# EAGLE design Main (EAGLE 7.1.0)

## Sheet 1 of 2
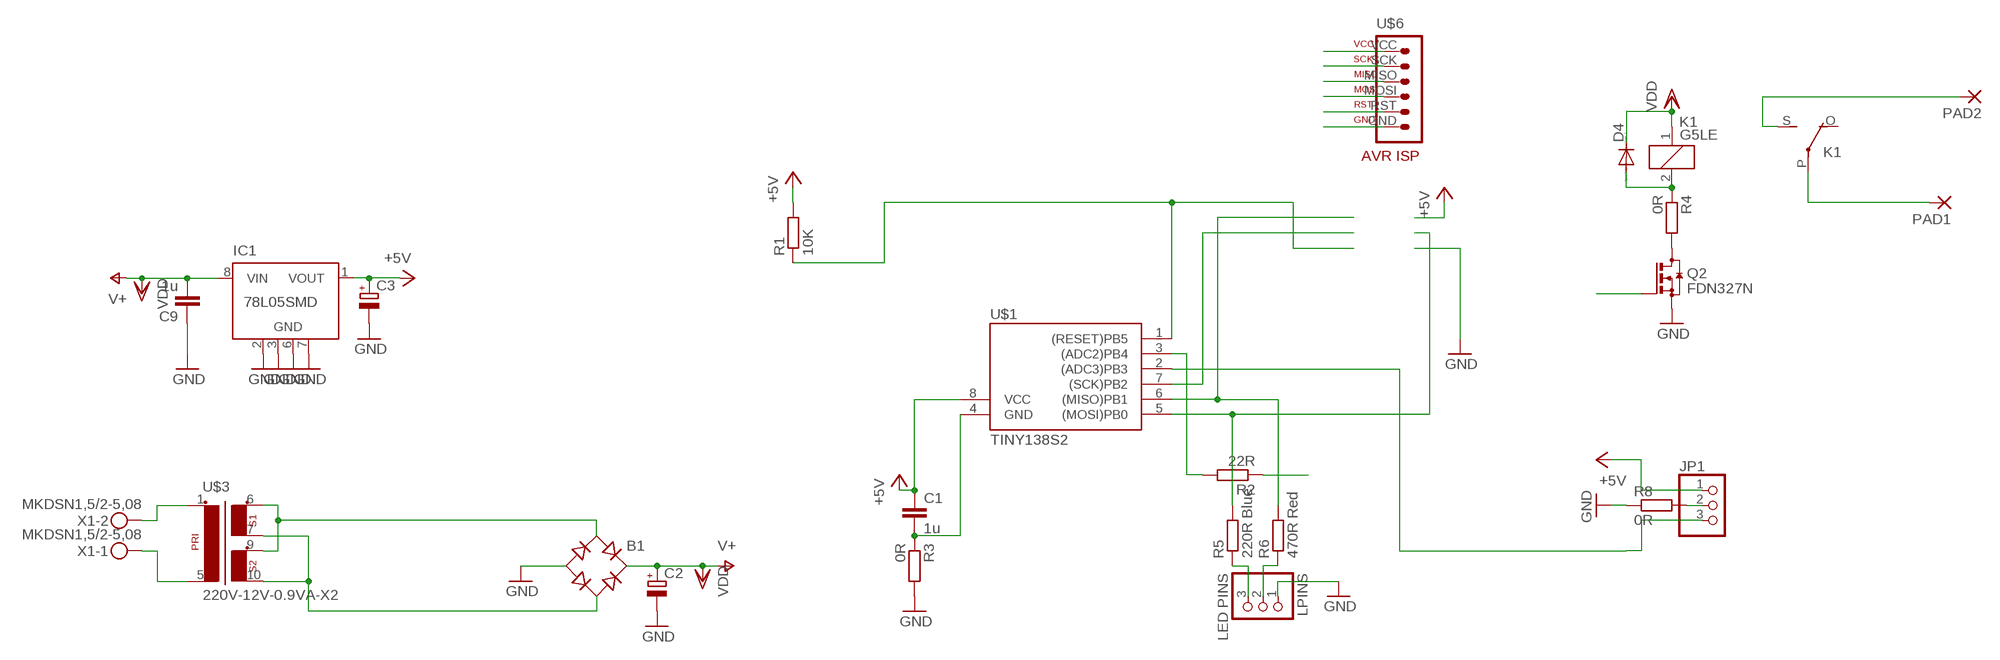
[diagram p0: schematic, sheet 1]

### Parts
B1  RB1A  [RB1A]
C1  1u  C-EUC1206  [C1206]
C2  CPOL-EUE5-13  [E5-13]
C3  CPOL-EUE2.5-7  [E2,5-7]
C9  1u  C-EUC1206  [C1206]
D4  DIODE-DO-214AC  [DO-214AC]
IC1  78L05SMD  [SO08]
JP1  PINHD-1X3/90  [1X03/90]
K1  G5LE  [G5LE]
LPINS  LED PINS  PINHD-1X3  [1X03]
PAD1  3,81/1,4  [3,81/1,4]
PAD2  3,81/1,4  [3,81/1,4]
Q2  FDN327N  BSS123  [SOT23]
R1  10K  R-EU_R1206  [R1206]
R2  22R  R-EU_R1206  [R1206]
R3  0R  R-EU_R1206  [R1206]
R4  0R  R-EU_R1206  [R1206]
R5  220R Blue  R-EU_R1206  [R1206]
R6  470R Red  R-EU_R1206  [R1206]
R8  0R  R-EU_R1206  [R1206]
U$1  TINY138S2  [SO08]
U$3  220V-12V-0.9VA-X2  [32.5-27.5-22]
U$6  AVR-ISP-6-ROW  [AVR-ISP-6-ROW]
X1  MKDSN1,5/2-5,08  [MKDSN1,5/2-5,08]

### Nets
+5V: C1.1 C3.+ IC1.1(VOUT) JP1.1 R1.2 U$1.8(VCC) U$6.VCC
GND: B1.- C2.- C3.- C9.1 IC1.2(GND) IC1.3(GND) IC1.6(GND) IC1.7(GND) LPINS.1 Q2.2(S) R3.2 R8.1 U$6.GND
N$1: R1.1 U$1.1((RESET)PB5) U$6.RST
N$3: U$1.7((SCK)PB2) U$6.SCK
N$4: R6.2 U$1.6((MISO)PB1) U$6.MISO
N$5: R5.2 U$1.5((MOSI)PB0) U$6.MOSI
N$9: Q2.1(G) R2.1
N$10: R2.2 U$1.3((ADC2)PB4)
N$11: LPINS.3 R5.1
N$12: LPINS.2 R6.1
N$13: D4.A K1.2 R4.1
N$14: U$3.1(P1-1) X1.2
N$15: U$3.5(P1-2) X1.1
N$16: B1.AC1 U$3.6(S1-1) U$3.9(S2-1)
N$17: B1.AC2 U$3.7(S1-2) U$3.10(S2-2)
N$18: Q2.3(D) R4.2
N$19: C1.2 R3.1 U$1.4(GND)
N$21: K1.P(2:P) PAD1.1(P)
N$22: K1.S(2:S) PAD2.1(P)
N$23: JP1.2 R8.2
N$70: JP1.3 U$1.2((ADC3)PB3)
VDD: B1.+ C2.+ C9.2 D4.C IC1.8(VIN) K1.1 ; supply symbol labelled V+
Unconnected: IC1.4(NC) IC1.5(NC) K1.O(2:O)

## Sheet 2 of 2
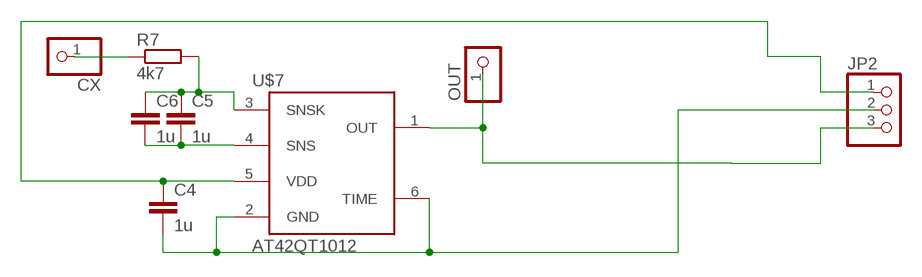
[diagram p1: schematic, sheet 2]

### Parts
C4  1u  C-EUC1206  [C1206]
C5  1u  C-EUC1206  [C1206]
C6  1u  C-EUC1206  [C1206]
CX  PINHD-1X1  [1X01]
JP2  PINHD-1X3/90  [1X03/90]
OUT  PINHD-1X1  [1X01]
R7  4k7  R-EU_R1206  [R1206]
U$7  AT42QT1012  [SOT23-6]

### Nets
N$2: CX.1 R7.1
N$6: C5.2 C6.2 U$7.4(SNS)
N$7: JP2.3 OUT.1 U$7.1(OUT)
N$8: C5.1 C6.1 R7.2 U$7.3(SNSK)
N$24: C4.1 JP2.1 U$7.5(VDD)
N$26: C4.2 JP2.2 U$7.2(GND) U$7.6(TIME)

## Library data of the parts
B1 = rectifier:RB1A: RECTIFIER 1 A
C1 C4-C6 C9 = rcl:C-EU: CAPACITOR, European symbol
C2 C3 = rcl:CPOL-EU: POLARIZED CAPACITOR, European symbol
CX OUT = pinhead:PINHD-1X1: PIN HEADER
D4 = diode:DIODE-: DIODE
IC1 = linear:78L*SMD: Positive VOLTAGE REGULATOR
JP1 JP2 LPINS = pinhead:PINHD-1X3: PIN HEADER
K1 = relay:G5LE: RELAY 1 x switch, 10 A/120 V AC, 8 A/30 V DC, Omron; OC_FARNELL: unknown; OC_NEWARK: unknown
PAD1 PAD2 = wirepad:3,81/1,4: THROUGH-HOLE PAD
Q2 = transistor-small-signal:BSS123: N-CHANNEL MOS FET
R1-R8 = rcl:R-EU_: RESISTOR, European symbol
U$1 = avr-7:TINY13*
U$3 = _Transformers:220V-12V-0.9VA-X2
U$6 = Namenlos:AVR-ISP-6-ROW
U$7 = Namenlos:AT42QT1012
X1 = con-phoenix-508:MKDSN1,5/2-5,08: MKDSN 1,5/ 2-5,08 Printklemme Nennstrom: 13,5 A Nennspannung: 250 V Rastermaß: 5,08 mm Polzahl: 2 Anschlussart: Schraubanschluss Montage: Löten Anschlussrichtung Leiter/Platine: 0 ° Artikelnummer: 1729128 Source: http://eshop.phoenixcontact.com .. 1729128.pdf

## Board
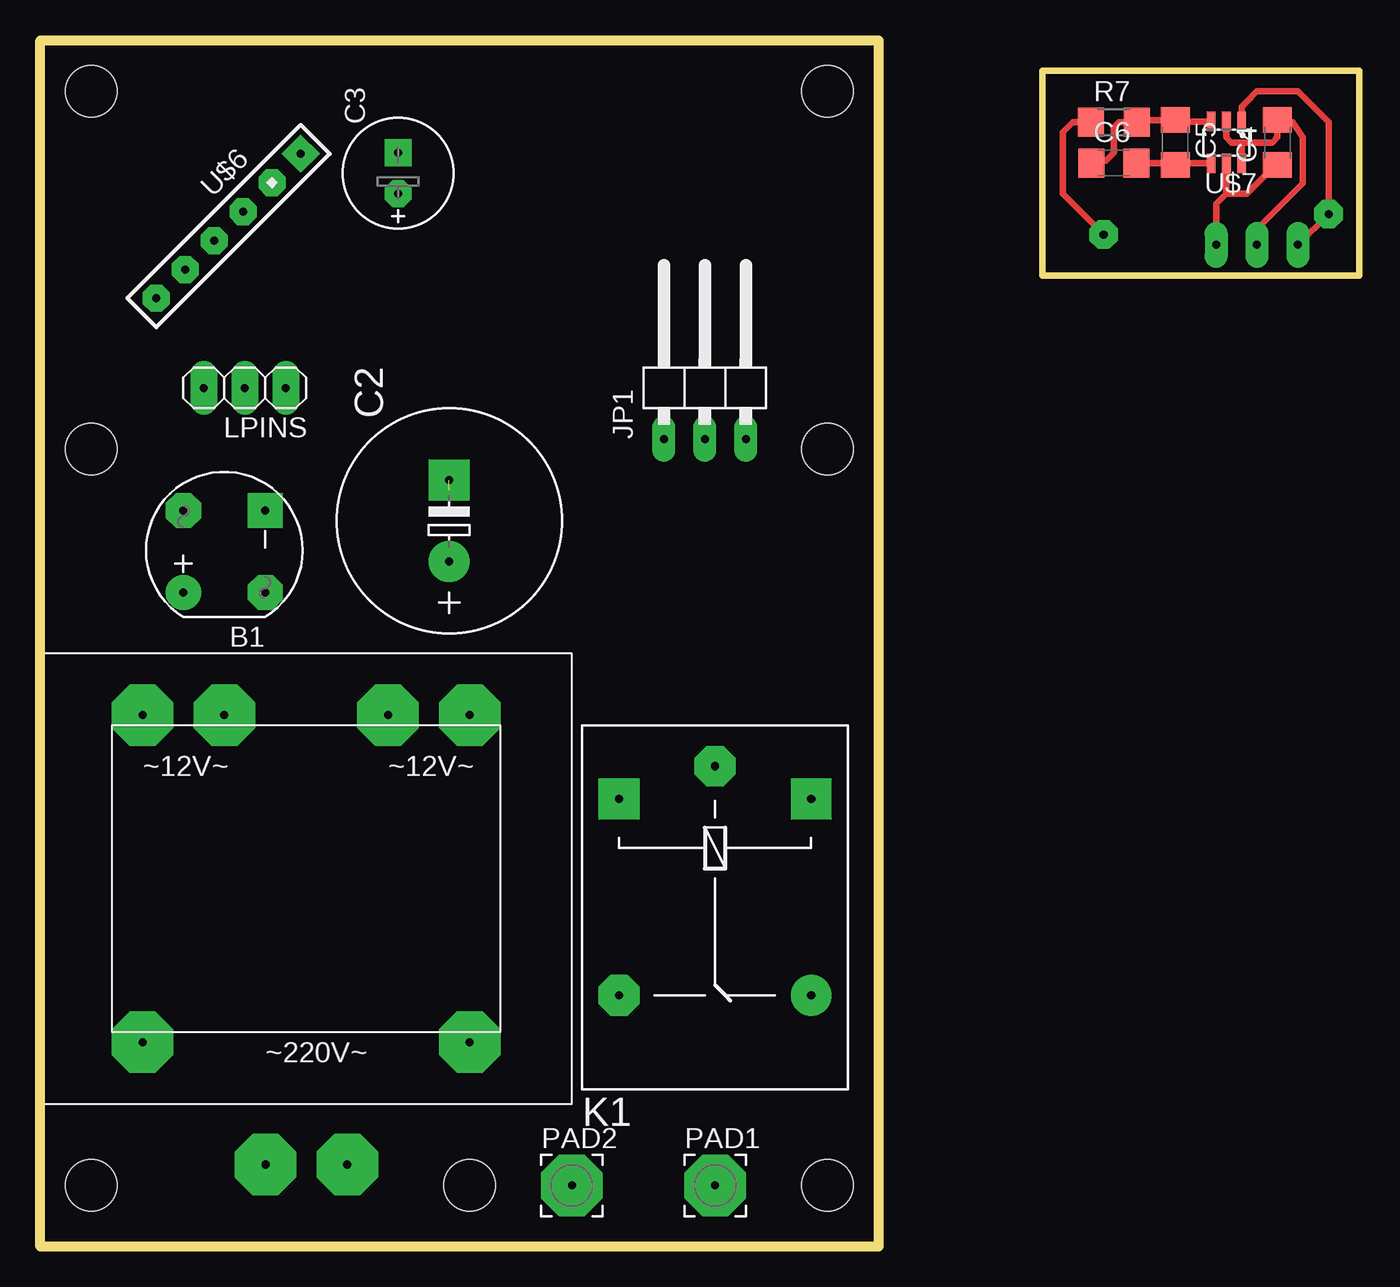
[diagram p2: board, top side]
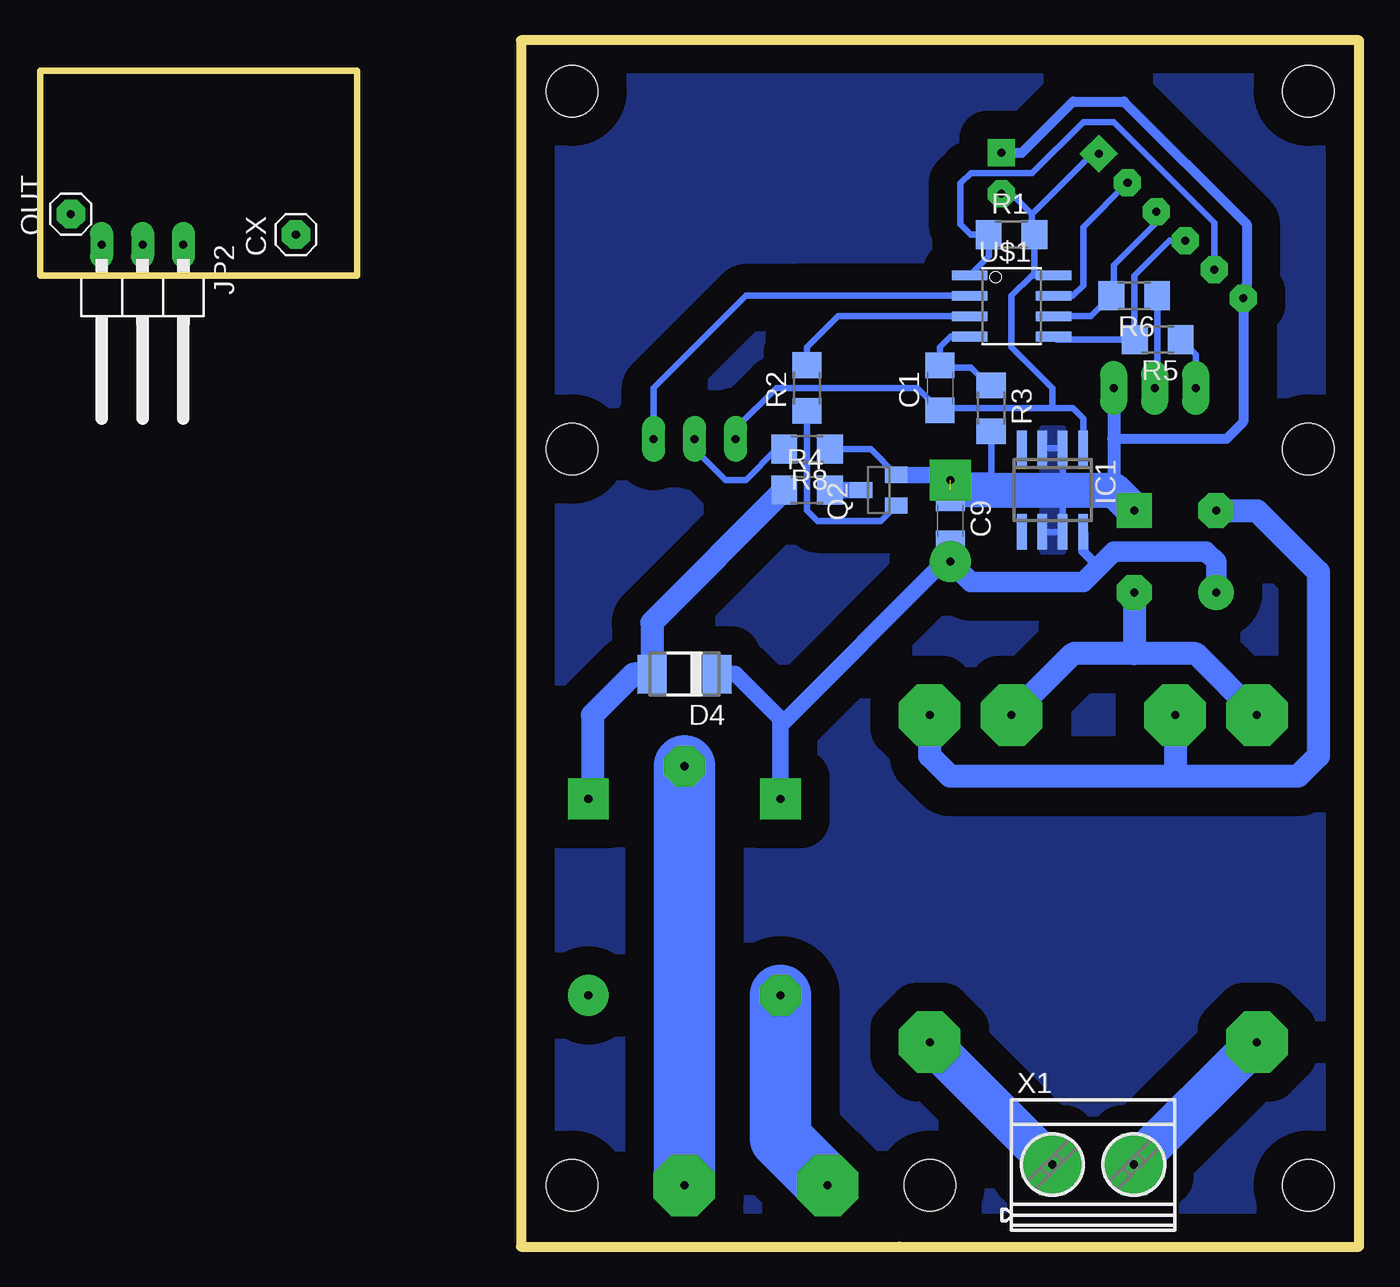
[diagram p3: board, bottom side, seen from below]

Size 81.92 x 74.93 mm. Coordinates in mm from the lower left corner, seen from the top.
Outline: 28.57,0 0,0 0,74.93 52.07,74.93 52.07,0 28.57,0
Outline: 81.92,60.33 81.92,73.03 62.23,73.03 62.23,60.33 81.92,60.33
Copper layers (1*16): Top 0.035mm / dielectric 1.5mm / Bottom 0.035mm
Design rules "default": minimum track width 10mil, minimum drill 24mil, track to track 8mil, track to pad 8mil, pad to pad 8mil, via to via 8mil, smd to smd 8mil, copper to edge 40mil, drill to drill 8mil, minimum pad ring 10mil, minimum via ring 8mil, stop-mask expansion 4mil, vias tented up to drill 0mil, thermal gap 10mil
Holes 3.2 mm at 3.17,71.75 3.17,49.53 48.9,49.53 48.9,71.75 3.17,3.81 48.9,3.81 26.67,3.81

### Footprints (pad centres in the part's own frame; a part is rotated, then mirrored left to right if it is on the bottom)
RB1A = drill 0.5 pad 2.184: + -2.54,2.54 | drill 0.5 pad 2.184 square: - 2.54,-2.54 | drill 0.5 pad 2.184 octagon: AC1 2.54,2.54; AC2 -2.54,-2.54
C1206 = smd 1.6 x 1.8: 1 -1.4,0; 2 1.4,0
E5-13 = drill 0.5 pad 2.54: + -2.54,0 | drill 0.5 pad 2.54 square: - 2.54,0
E2,5-7 = drill 0.5 pad 1.676 octagon: + -1.27,0 | drill 0.5 pad 1.676 square: - 1.27,0
1X01 = drill 0.5 pad 1.778 octagon: 1 0,0
DO-214AC = smd 1.8 x 2.4: A 2.025,0; C -2.025,0
SO08 = smd 0.6 x 2.2: 1 -1.905,-2.6; 2 -0.635,-2.6; 3 0.635,-2.6; 4 1.905,-2.6; 5 1.905,2.6; 6 0.635,2.6; 7 -0.635,2.6; 8 -1.905,2.6
1X03/90 = drill 0.5 pad 1.422 long: 1 -2.54,-3.81; 2 0,-3.81; 3 2.54,-3.81
G5LE = drill 0.5 pad 2.54 square: 1 -7.493,-5.969; 2 -7.493,5.969 | drill 0.5 pad 2.54: O 4.699,5.969 | drill 0.5 pad 2.54 octagon: P -9.525,0; S 4.699,-5.969
1X03 = drill 0.5 pad 1.676 long: 1 -2.54,0; 2 0,0; 3 2.54,0
3,81/1,4 = drill 0.5 pad 3.81 octagon: 1 0,0
SOT23 = smd 1 x 1.4: 1 -0.95,-1.1; 2 0.95,-1.1; 3 0,1.1
R1206 = smd 1.6 x 1.803: 1 -1.422,0; 2 1.422,0
SO08' = smd 0.61 x 2.21: 1 -1.905,-2.616; 2 -0.635,-2.616; 3 0.635,-2.616; 4 1.905,-2.616; 5 1.905,2.616; 6 0.635,2.616; 7 -0.635,2.616; 8 -1.905,2.616
32.5-27.5-22 = drill 0.5 pad 3.81 octagon: 1 -10.16,-10.16; 5 10.16,-10.16; 6 10.16,10.16; 7 5.08,10.16; 9 -5.08,10.16; 10 -10.16,10.16
AVR-ISP-6-ROW = drill 0.5 pad 1.676 octagon: GND 6.35,0; MISO -1.27,0; MOSI 1.27,0; RST 3.81,0; SCK -3.81,0 | drill 0.5 pad 1.676 square: VCC -6.35,0
SOT23-6 = smd 0.55 x 1.2: 1 -0.95,-1.3; 2 0,-1.3; 3 0.95,-1.3; 4 0.95,1.3; 5 0,1.3; 6 -0.95,1.3
MKDSN1,5/2-5,08 = drill 0.5 pad 3.81 octagon: 1 -2.561,0.025; 2 2.519,0.025

### Placement (x,y rotation side)
B1  11.43,43.18 90 top
C1  26.04,53.34 90 bottom
C2  25.4,45.09 90 top
C3  22.23,66.67 90 top
C4  76.83,68.58 90 top
C5  70.48,68.58 270 top
C6  66.67,67.31 0 top
C9  25.4,45.09 270 bottom
CX  66.04,62.87 90 bottom
D4  41.91,35.56 180 bottom
IC1  19.05,46.99 180 bottom
JP1  41.27,53.98 0 top
JP2  75.56,58.42 180 bottom
K1  41.91,20.32 270 top
LPINS  12.7,53.34 180 top
OUT  80.01,64.14 90 bottom
PAD1  41.91,3.81 0 top
PAD2  33.02,3.81 0 top
Q2  29.84,46.99 90 bottom
R1  21.59,62.87 0 bottom
R2  34.29,53.34 90 bottom
R3  22.86,52.07 270 bottom
R4  34.29,46.99 0 bottom
R5  12.51,56.33 180 bottom
R6  13.97,59.05 180 bottom
R7  66.67,69.85 0 top
R8  34.29,49.53 180 bottom
U$1  TINY138S2  [SO08']  21.59,58.42 270 bottom
U$3  16.51,22.86 0 top
U$6  11.69,63.39 225 top
U$7  73.66,68.58 180 top
X1  16.51,5.08 0 bottom

### Tracks (layer width: path | path; a pad name or v marks a point on that pad's centre or on a via)
+5V
  Bottom 0.406: C3.+ 21.59,65.41 20.32,64.14 | 20.32,64.14 20.32,63.02 R1.2 20.17,60.48 20.32,60.33 | IC1.1 17.14,51.44 17.78,52.07 19.05,52.07 | 19.05,52.07 25.91,52.07 C1.1 27.43,53.34 36.2,53.34 38.73,50.8 JP1.1 | 19.05,52.07 19.05,53.34 21.59,55.88 21.59,59.05 20.32,60.33 | 20.32,60.33 U$1.8 | U$6.VCC 16.57,67.88 20.32,64.14
GND  (1 unrouted)
  Bottom 0.406: IC1.6 IC1.7 18.41,46.99 IC1.2 IC1.3 | R3.2 22.86,46.99 | R8.1 30.34,49.53 Q2.2
  Bottom 0.61: C3.- 20.95,67.94 17.78,71.12 14.61,71.12 6.99,63.5 6.99,59.75 U$6.GND 7.2,51.22 8.26,50.16 15.24,50.16
  Bottom 0.813: LPINS.1 15.24,50.16 15.24,46.99
  Bottom 1.016: 25.72,46.67 25.4,46.67 25.4,46.99 24.89,46.99 | 24.77,46.99 24.89,46.99 | 24.89,46.99 C9.1 | Q2.2 25.4,47.94 C2.-
  Bottom 2.184: B1.- 15.24,46.99 18.41,46.99 22.86,46.99 24.77,46.99
  pour Bottom (no thermals): 18.41,43.18 19.68,43.18 19.68,50.8 18.41,50.8
N$1
  Bottom 0.406: R1.1 23.01,63.02 | R1.1 23.01,61.52 U$1.1 | U$6.RST 9,63.61 15.24,69.85 17.14,69.85 20.32,66.67 24.13,66.67 24.77,66.04 24.77,63.5 24.13,62.87 R1.1
N$2
  Top 0.406: CX.1 64.14,64.77 63.5,65.41 63.5,69.22 64.14,69.85 R7.1
N$3
  Bottom 0.406: U$1.7 17.78,59.05 17.14,59.69 17.14,63.33 U$6.SCK
N$4
  Bottom 0.406: U$1.6 16.66,57.78 R6.2 15.24,59.21 15.24,60.96 11.96,64.24 U$6.MISO
N$5
  Bottom 0.406: U$1.5 18.79,56.33 R5.2 13.97,56.36 13.97,60.33 11.8,62.49 U$6.MOSI
N$6
  Top 0.406: U$7.4 70.58,67.28 C5.2 70.36,67.31 C6.2
N$7
  Top 0.406: U$7.1 74.61,70.8 74.93,71.12 75.56,71.75 78.11,71.75 80.01,69.85 80.01,66.04 OUT.1 JP2.3
N$8
  Top 0.406: U$7.3 70.58,69.88 C5.1 68.23,69.98 R7.2 66.99,69.85 66.67,69.53 66.67,67.94 66.19,67.46 65.41,67.46 C6.1
N$9
  Bottom 0.406: R2.1 34.29,45.72 33.66,45.09 29.7,45.09 Q2.1
N$10
  Bottom 0.406: U$1.3 32.38,57.78 34.29,55.88 R2.2
N$11
  Bottom 0.406: LPINS.3 10.16,55.4 R5.1
N$12
  Bottom 0.406: R6.1 12.55,53.49 LPINS.2
N$13
  Bottom 0.61: 47.62,28.07 K1.2
  Bottom 1.422: R4.1 43.94,38.77 D4.A 45.09,35.56 47.62,33.02 47.62,28.07
N$14
  Bottom 2.54: U$3.1 6.4,12.7 X1.2
N$15
  Bottom 2.54: X1.1 U$3.5
N$16
  Bottom 1.422: 11.43,29.21 25.4,29.21 26.67,30.48 U$3.6 | B1.AC1 6.35,45.72 2.54,41.91 2.54,30.48 3.81,29.21 11.43,29.21 | U$3.9 11.43,29.21
N$17
  Bottom 1.422: U$3.10 10.16,36.83 13.97,36.83 | 13.97,36.83 17.78,36.83 U$3.7 | B1.AC2 13.97,36.83
N$18
  Bottom 1.016: Q2.3 R4.2
N$19
  Bottom 0.406: R3.1 23.01,53.49 24.13,54.61 25.91,54.61 C1.2 | 26.23,54.93 C1.2 | U$1.4 25.4,56.52 26.04,55.88 C1.2
N$20
  pour Bottom (isolate 1.778, no thermals): 0,0 0,74.93 52.07,74.93 52.07,0
N$21
  Bottom 3.81: K1.P PAD1.1
N$22
  Bottom 3.81: K1.S 35.94,6.73 PAD2.1
N$23
  Bottom 0.406: 36.2,49.53 R8.2 36.2,49.53 | JP1.2 41.27,49.53 39.37,47.62 38.1,47.62 36.2,49.53
N$24
  Top 0.406: U$7.5 73.66,66.67 73.66,65.41 | C4.1 76.33,66.67 76.2,66.67 74.93,65.41 73.66,65.41 | JP2.1 73.03,64.77 73.66,65.41
N$26
  Top 0.406: C4.2 76.33,69.98 76.33,69.67 | C4.2 76.97,69.85 77.79,69.85 78.42,68.9 78.42,66.04 75.56,63.18 JP2.2 | U$7.2 73.66,68.9 73.98,68.58 74.61,68.58 | 74.61,68.58 76.52,68.58 76.83,68.9 C4.2 | U$7.6 74.61,68.58
N$70
  Bottom 0.406: U$1.2 34.92,59.05 38.1,59.05 43.81,53.34 JP1.3
VDD
  Bottom 0.61: IC1.8 17.14,43.18 16.19,42.23 | C2.+ C9.2
  Bottom 1.016: K1.1 35.94,32.38 | 35.94,32.38 35.94,32.77 38.73,35.56 D4.C | C2.+ 25.78,42.55 35.94,32.38
  Bottom 1.27: C2.+ 24.13,41.27 17.14,41.27 16.19,42.23 15.24,43.18 9.53,43.18 8.89,42.55 B1.+